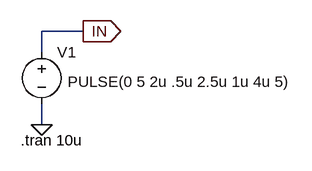
[diagram p0: schematic Pulse.asc]
Pulse.asc, the LTspice schematic file:
Version 4
SHEET 1 880 680
WIRE 48 48 -16 48
WIRE -16 80 -16 48
WIRE -16 192 -16 160
FLAG -16 192 0
FLAG 48 48 IN
IOPIN 48 48 Out
SYMBOL voltage -16 64 R0
WINDOW 3 40 62 Left 0
WINDOW 39 0 0 Left 0
SYMATTR Value PULSE(0 5 2u .5u 2.5u 1u 4u 5)
SYMATTR InstName V1
SYMATTR Value2 AC 1
TEXT -48 216 Left 0 !.tran 10u

The netlist it stands for:
* Pulse.asc
V1 IN 0 PULSE(0 5 2u .5u 2.5u 1u 4u 5) AC 1
.tran 10u
.backanno
.end